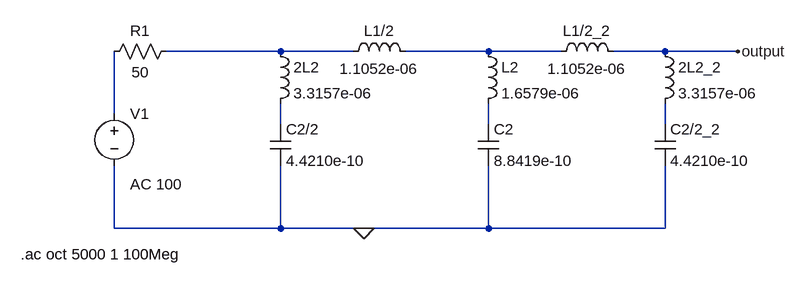
[diagram p0: schematic filtrDolnoprzepustowyTypuT.asc]
filtrDolnoprzepustowyTypuT.asc, the LTspice schematic file:
Version 4
SHEET 1 880 680
WIRE -144 16 -320 16
WIRE -32 16 -144 16
WIRE 176 16 48 16
WIRE 288 16 176 16
WIRE 448 16 368 16
WIRE 560 16 448 16
WIRE -400 112 -400 16
WIRE -144 128 -144 96
WIRE 176 128 176 96
WIRE 448 128 448 96
WIRE -400 288 -400 192
WIRE -144 288 -144 192
WIRE -144 288 -400 288
WIRE -16 288 -144 288
WIRE 176 288 176 192
WIRE 176 288 -16 288
WIRE 448 288 448 192
WIRE 448 288 176 288
FLAG 560 16 output
FLAG -16 288 0
SYMBOL cap -160 128 R0
SYMATTR InstName C2/2
SYMATTR Value 4.4210e-10
SYMBOL cap 160 128 R0
SYMATTR InstName C2
SYMATTR Value 8.8419e-10
SYMBOL cap 432 128 R0
SYMATTR InstName C2/2_2
SYMATTR Value 4.4210e-10
SYMBOL ind -160 0 R0
SYMATTR InstName 2L2
SYMATTR Value 3.3157e-06
SYMBOL ind -48 32 R270
WINDOW 0 32 56 VTop 2
WINDOW 3 5 56 VBottom 2
SYMATTR InstName L1/2
SYMATTR Value 1.1052e-06
SYMBOL ind 160 0 R0
SYMATTR InstName L2
SYMATTR Value 1.6579e-06
SYMBOL ind 272 32 R270
WINDOW 0 32 56 VTop 2
WINDOW 3 5 56 VBottom 2
SYMATTR InstName L1/2_2
SYMATTR Value 1.1052e-06
SYMBOL ind 432 0 R0
SYMATTR InstName 2L2_2
SYMATTR Value 3.3157e-06
SYMBOL voltage -400 96 R0
WINDOW 123 24 124 Left 2
WINDOW 39 0 0 Left 0
SYMATTR Value2 AC 100
SYMATTR InstName V1
SYMATTR Value ""
SYMBOL res -304 0 R90
WINDOW 0 0 56 VBottom 2
WINDOW 3 32 56 VTop 2
SYMATTR InstName R1
SYMATTR Value 50
TEXT -544 328 Left 2 !.ac oct 5000 1 100Meg

The netlist it stands for:
* filtrDolnoprzepustowyTypuT.asc
C2/2 N004 0 4.4210e-10
C2 N005 0 8.8419e-10
C2/2_2 N006 0 4.4210e-10
L§2L2 N001 N004 3.3157e-06
L1/2 N001 N002 1.1052e-06
L2 N002 N005 1.6579e-06
L1/2_2 N002 output 1.1052e-06
L§2L2_2 output N006 3.3157e-06
V1 N003 0 AC 100
R1 N001 N003 50
.ac oct 5000 1 100Meg
.backanno
.end